# Altium schematic sheet US_SB_OS.SchDoc
size A4
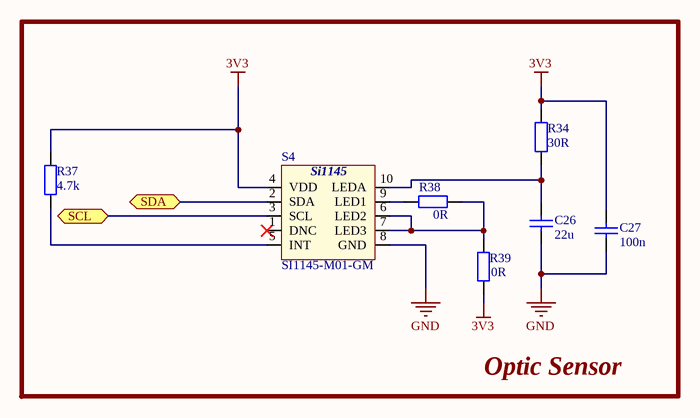
[diagram p0: US_SB_OS.SchDoc]

## Parts
C26  22u  [C0805_IPC_HD]
C27  100n  [C0603_IPC_HD]
R34  30R  [C0603_IPC_HD]
R37  4.7k  [R0603_IPC_HD]
R38  0R  [R0603_IPC_MD]
R39  0R  [R0603_IPC_MD]
S4  SI1145-M01-GM  [Si1145]

## Blocks framed on the sheet
Optic Sensor: C26 C27 R34 R37-R39 S4

## Ports
SCL, SDA

## Nets
3V3: C27.1 R34.1 R37.2 R39.2 S4.4(VDD)
GND: C26.1 C27.2 S4.8(GND)
SCL: S4.3(SCL) ; port SCL
SDA: S4.2(SDA) ; port SDA
NetC26_2: C26.2 R34.2 S4.10(LEDA)
NetR37_1: R37.1 S4.5(INT)
NetR38_1: R38.1 R39.1 S4.6(LED2) S4.7(LED3)
NetR38_2: R38.2 S4.9(LED1)

Not connected (* = marked no-connect by the designer): S4 1(DNC)*

## Library data of the parts
C26 = CL21A226MOCLRNC: CAP CER 22UF 16V X5R 0805; Manufacturer: Samsung Electro-Mechanics; Manufacturer Part Number: CL21A226MOCLRNC; Voltage: 16V; Value: 22u; Dielectric: X5R; Supplier 1: Digi-Key; Supplier Part Number 1: 1276-6780-1-ND
C27 = CL10B104KO8NNNC: CAP CER 0.1UF 16V X7R 0603; Manufacturer: Samsung Electro-Mechanics; Manufacturer Part Number: CL10B104KO8NNNC; Voltage: 16V; Value: 100n; Dielectric: X7R; Supplier 1: Digi-Key; Supplier Part Number 1: 1276-1005-1-ND
R34 = CR0603-JW-30Ohm: RES SMD 30 OHM 5% 1/10W 0603; Manufacturer: Bourns Inc.; Manufacturer Part Number: CR0603-JW-300ELF; Value: 30R; Tolarance: ±5%; Supplier 1: Digi-Key; Supplier Part Number 1: CR0603-JW-300ELFCT-ND
R37 = CR0603-JW-4.7k: RES SMD 4.7K OHM 5% 1/10W 0603; Manufacturer: Bourns Inc.; Manufacturer Part Number: CR0603-JW-472ELF; Value: 4.7k; Tolarance: ±5%; Supplier 1: Digi-Key; Supplier Part Number 1: CR0603-JW-472ELFCT-ND
R38 R39 = CR0603-J/-000ELF: RES SMD 0 OHM JUMPER 1/10W 0603; Manufacturer: Bourns Inc.; Tolarance: 1%; Value: 0R; Manufacturer Part Number: CR0603-J/-000ELF; Supplier 1: Digi-Key; Supplier Part Number 1: CR0603-J/-000ELFCT-ND
S4 = Si1145: Optical Sensor Ambient, IR, Ultraviolet (UV) 850nm I²C 10-SMD Module, No Lead; Manufacturer: Silicon Labs; Manufacturer Part Number: SI1145-M01-GM; Supplier 1: Digi-Key; Supplier Part Number 1: 336-5135-ND